# Altium project Pump_Agri.PrjPcb
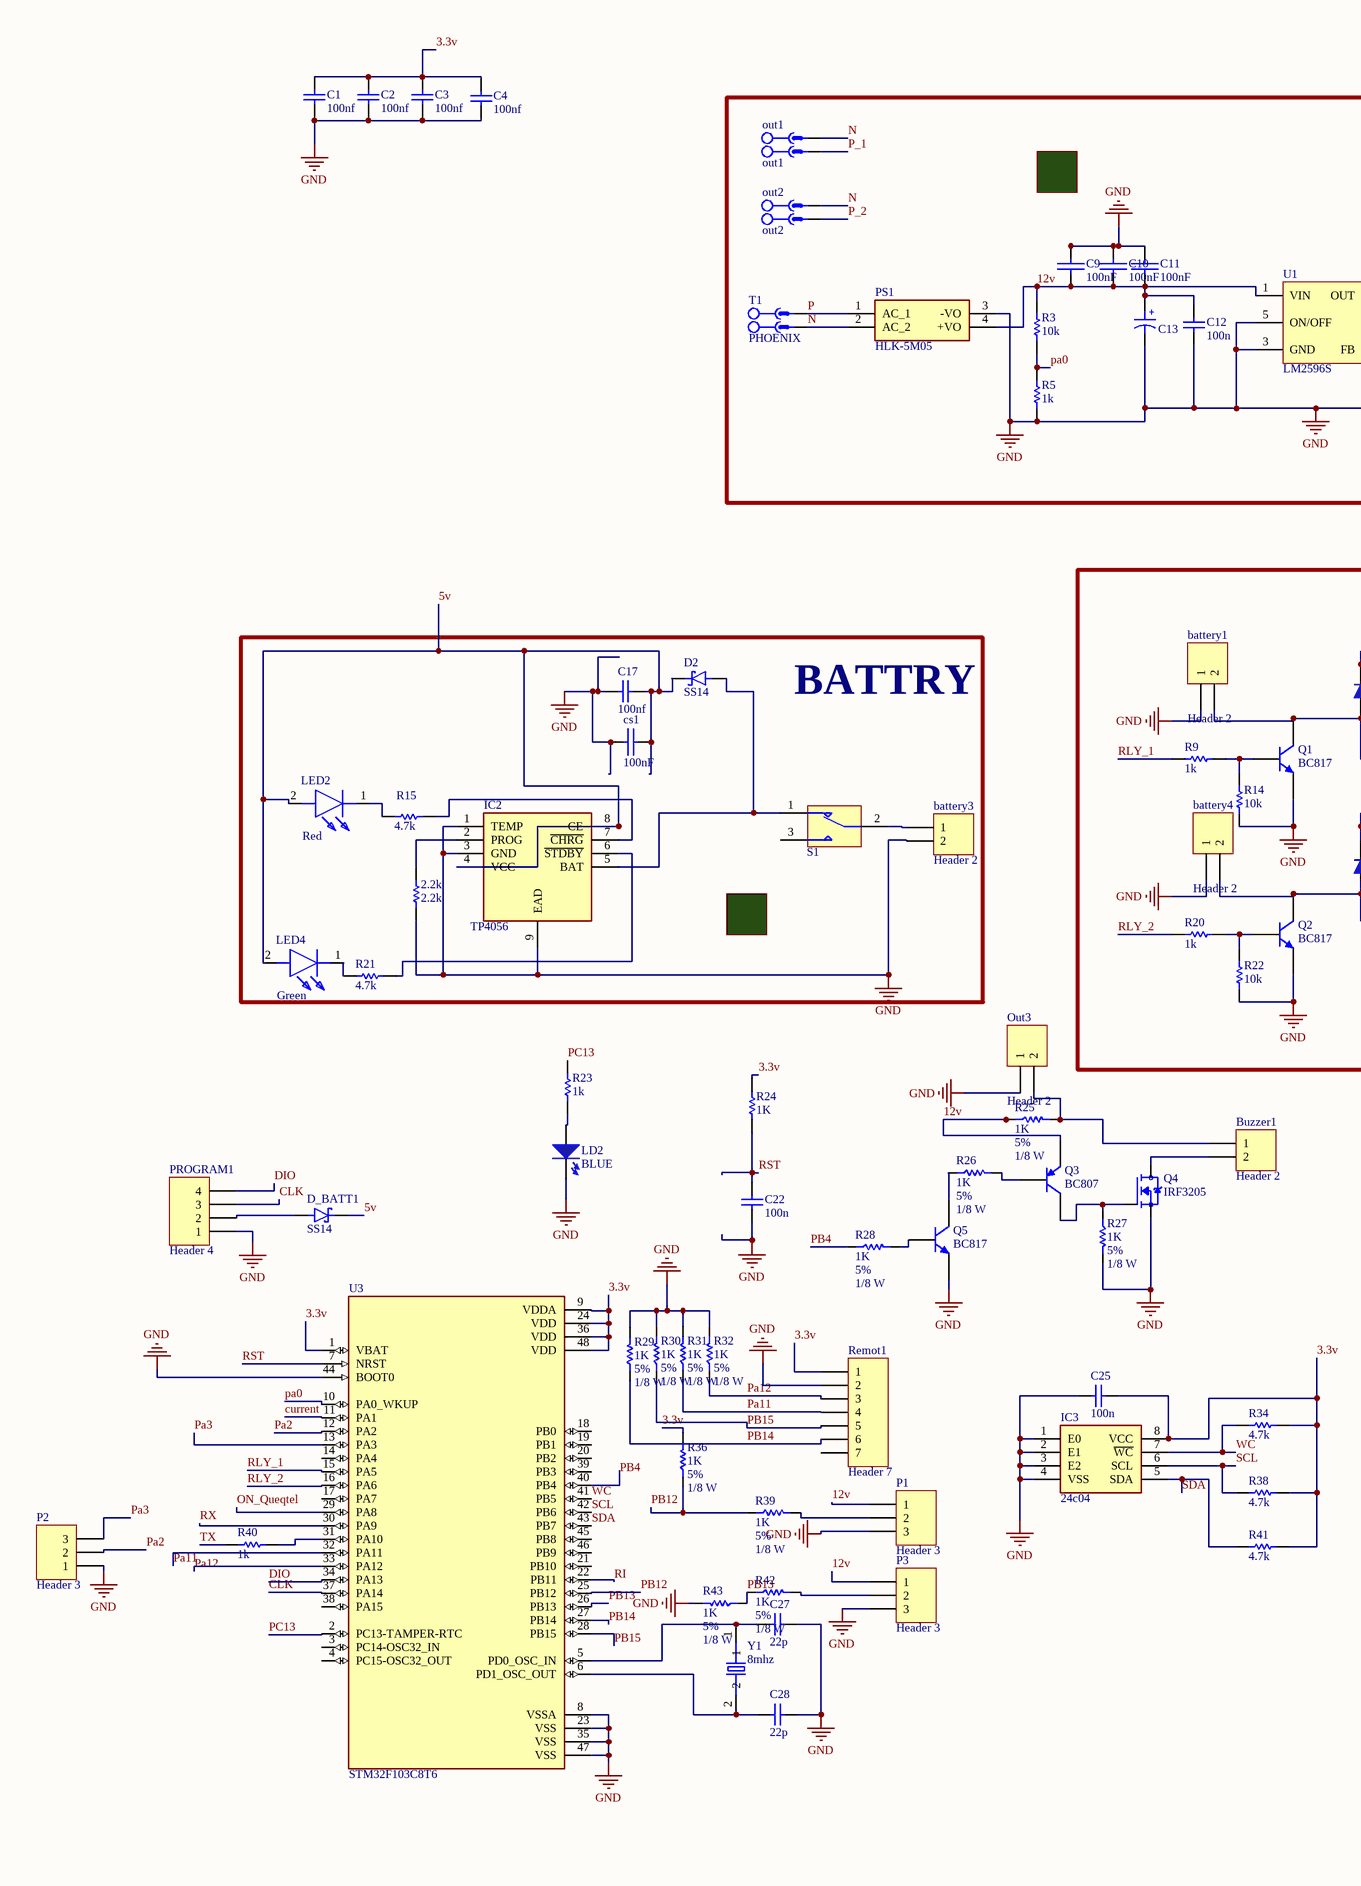
[diagram p0: Pump_Agri.SchDoc, left]
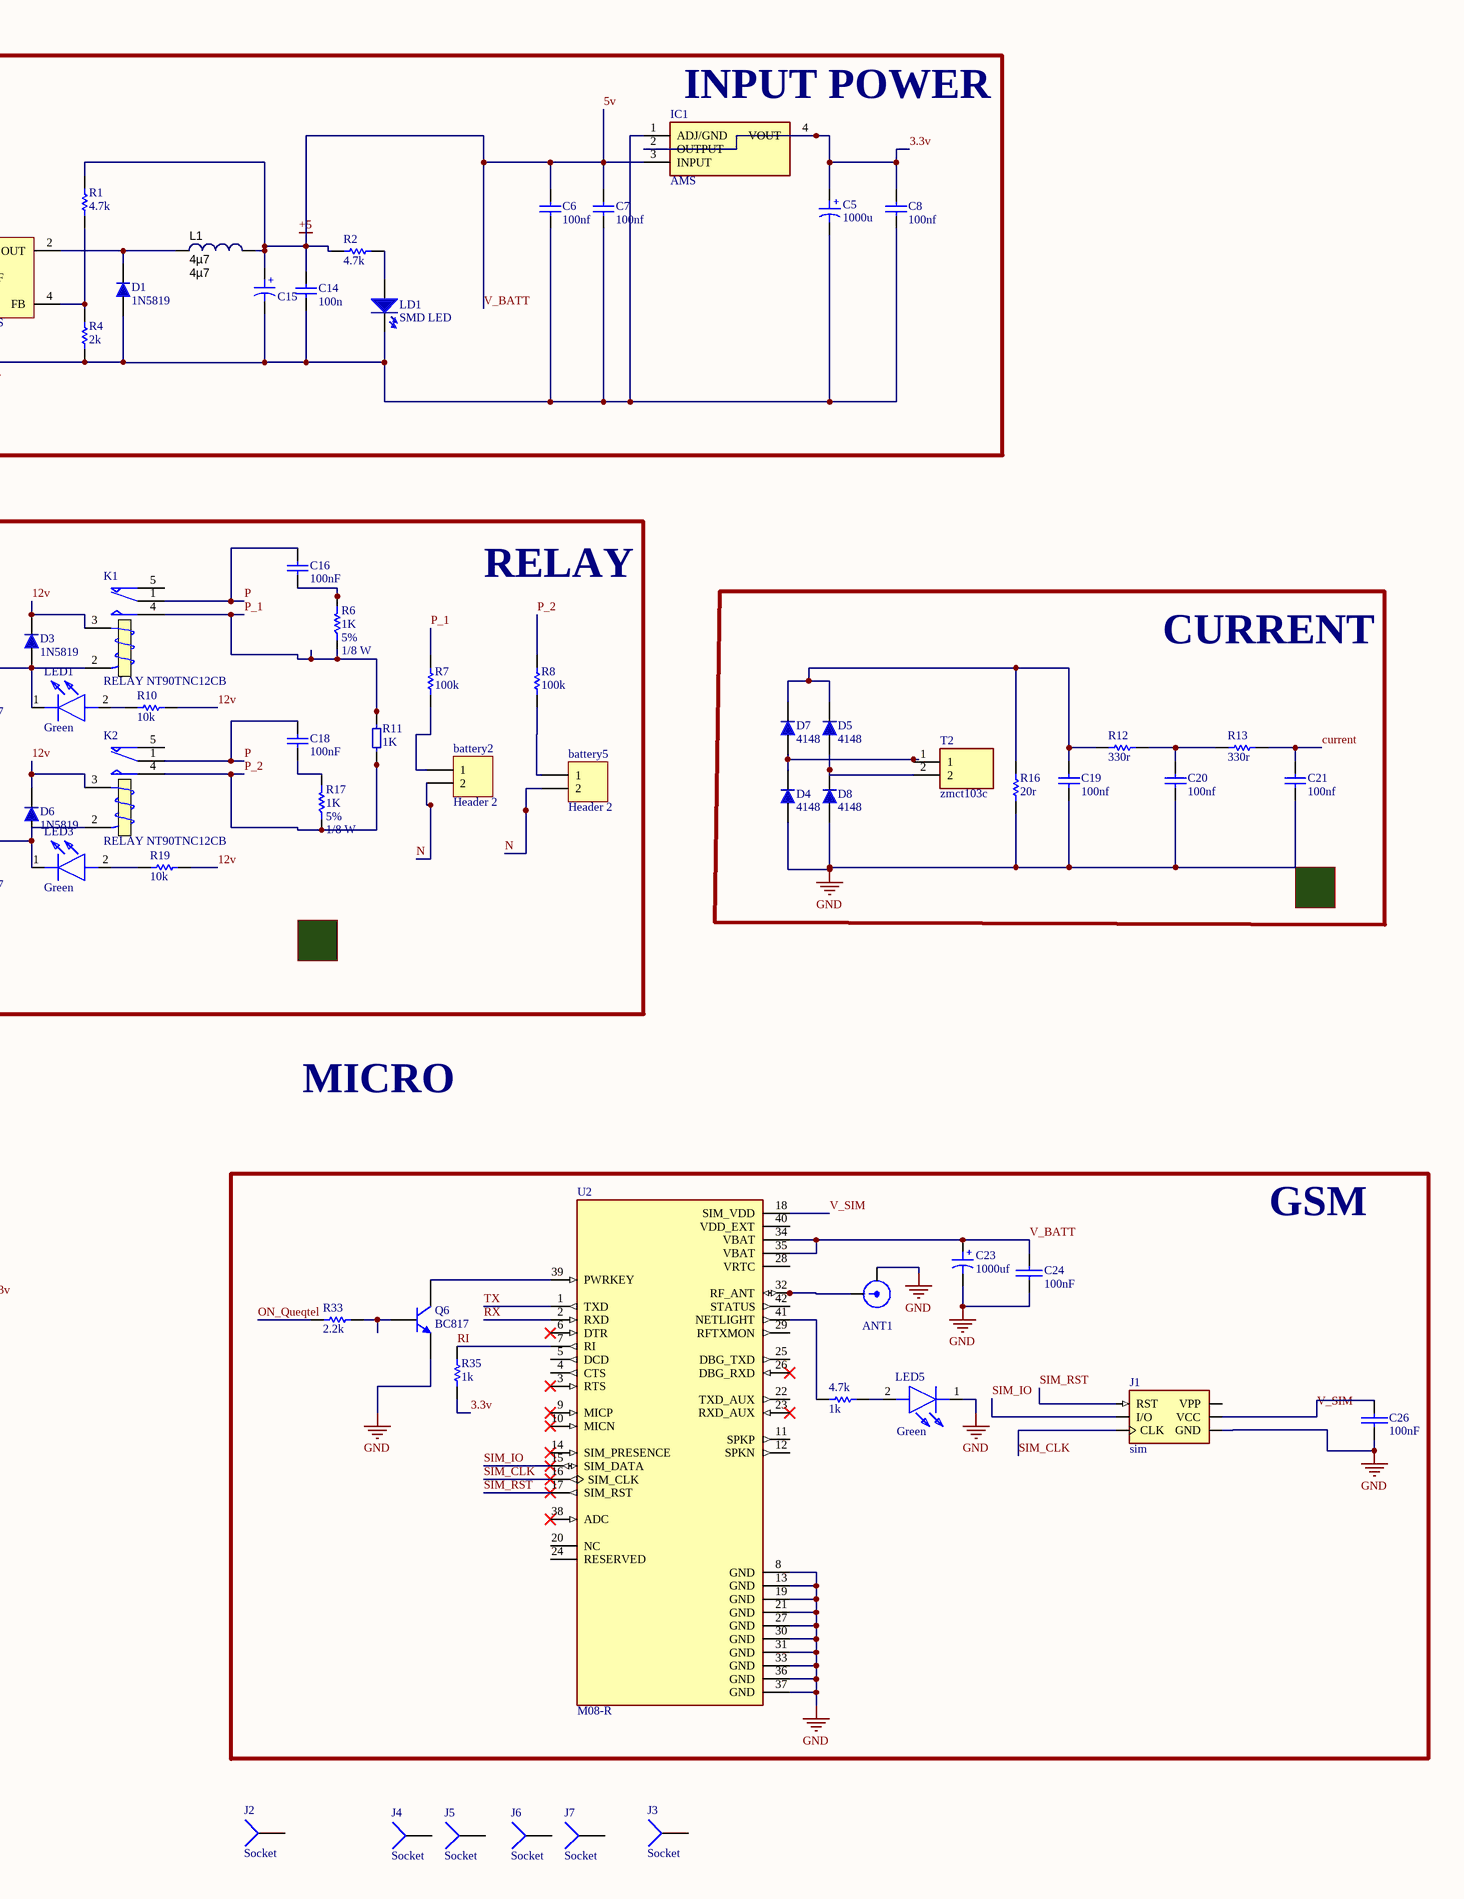
[diagram p1: Pump_Agri.SchDoc, right]
1 sheet, 130 parts. Net scope: global (net labels, ports and power ports of the same name join across sheets).
Board files: Pump_Agri.PcbDoc, PCB2.PcbDoc

## Sheet Pump_Agri.SchDoc
size A2; SheetNumber: 1; SheetTotal: 1

### Parts
2.2k  2.2k  [RESC3413X04N]
4.7k  1k  [RESC3413X04N]
ANT1  ANT U.FL  [U.FL SMD]  (value not drawn)
battery1  Header 2  [HDR1X2]
battery2  Header 2  [HDR1X2]
battery3  Header 2  [HDR1X2]
battery4  Header 2  [HDR1X2]
battery5  Header 2  [HDR1X2]
Buzzer1  Header 2  [HDR1X2]
C1  100nf  [CAPC3413X12N]
C2  100nf  [CAPC3413X12N]
C3  100nf  [CAPC3413X12N]
C4  100nf  [CAPC3413X12N]
C5  1000u  [Cap electrolitic radial 8x12-3.5]
C6  100nf  [CAPC3413X12N]
C7  100nf  [CAPC3413X12N]
C8  100nf  [CAPC3413X12N]
C9  100nF  [SMD_CAP_1206]
C10  100nF  [SMD_CAP_1206]
C11  100nF  [SMD_CAP_1206]
C12  100n  [CAPC3413X12N]
C13  1000u  [Cap electrolitic radial 10x20-5]  (value not drawn)
C14  100n  [CAPC3413X12N]
C15  100u  [Cap electrolitic radial 10x20-5]  (value not drawn)
C16  100nF  [Cap-10nF-630V]
C17  100nf  [CAPC3413X12N]
C18  100nF  [Cap-10nF-630V]
C19  100nf  [CAPC3413X12N]
C20  100nf  [CAPC3413X12N]
C21  100nf  [CAPC3413X12N]
C22  100n  [CAPC3413X12N]
C23  1000uf  [Cap electrolitic radial 8x12-3.5]
C24  value 100nF  [CAP0805]  (hidden comment: 100N)
C25  100n  [CAPC3413X12N]
C26  value 100nF  [CAP0805]  (hidden comment: 100N)
C27  22p  [CAPC3413X12N]
C28  22p  [CAPC3413X12N]
cs1  100nF  [SMD_CAP_1206]
D1  1N5819  [DO-214AA(SMA)]
D2  SS14  [DIOM4325X250N]
D3  1N5819  [DO-214AA(SMA)]
D4  4148  [SOD80, LL-34]
D5  4148  [SOD80, LL-34]
D6  1N5819  [DO-214AA(SMA)]
D7  4148  [SOD80, LL-34]
D8  4148  [SOD80, LL-34]
D_BATT1  SS14  [DIOM4325X250N]
IC1  AMS  [SOT230P700X180-4N]
IC2  TP4056  [SOIC127P600X175-9N]
IC3  24c04  [SOIC127P600X175-8N]
J1  sim  [GCT_SIM5060-6-0-26-01-X_REVC]
J2  Socket  [Test Point]
J3  Socket  [Test Point]
J4  Socket  [Test Point]
J5  Socket  [Test Point]
J6  Socket  [Test Point]
J7  Socket  [Test Point]
K1  RELAY NT90TNC12CB  [RELAY NT90TNC12CB]
K2  RELAY NT90TNC12CB  [RELAY NT90TNC12CB]
L1  4µ7  [Inductor SMD 3x3.2mm]
LD1  SMD LED  [LED_0805 G]
LD2  BLUE  [LED_0805 G]
LED1  Green  [LEDC2012X80N]
LED2  Red  [LEDC2012X80N]
LED3  Green  [LEDC2012X80N]
LED4  Green  [LEDC2012X80N]
LED5  Green  [LEDC2012X80N]
out1  out1  [MSTBV 2,5/2-G-5]
out2  out2  [MSTBV 2,5/2-G-5]
Out3  Header 2  [HDR1X2]
P1  Header 3  [HDR1X3]
P2  Header 3  [HDR1X3]
P3  Header 3  [HDR1X3]
PROGRAM1  Header 4  [HDR1X4]
PS1  HLK-5M05  [HLK5M05]
Q1  BC817  [SOT-23]
Q2  BC817  [SOT-23]
Q3  BC807  [SOT23_BEC_N]
Q4  IRF3205  [TO254P1041X444X2933-3]
Q5  BC817  [SOT23_BEC_N]
Q6  BC817  [SOT-23]
R1  4.7k  [RESC3413X04N]
R2  4.7k  [RESC3413X04N]
R3  10k  [RESC3413X04N]
R4  2k  [RESC3413X04N]
R5  1k  [RESC3413X04N]
R6  Tolerance: 5%  Power: 1/8 W  [Res-(1/4)-Stand]  (hidden comment: 1K)
R7  100k  [RESC3413X04N]
R8  100k  [RESC3413X04N]
R9  1k  [RESC3413X04N]
R10  10k  [RESC3413X04N]
R11  Resistor SMD  [2512 Resistor]  (value not drawn)
R12  330r  [RESC3413X04N]
R13  330r  [RESC3413X04N]
R14  10k  [RESC3413X04N]
R15  4.7k  [RESC3413X04N]
R16  20r  [RESC3413X04N]
R17  Tolerance: 5%  Power: 1/8 W  [Res-(1/4)-Stand]  (hidden comment: 1K)
R19  10k  [RESC3413X04N]
R20  1k  [RESC3413X04N]
R21  4.7k  [RESC3413X04N]
R22  10k  [RESC3413X04N]
R23  1k  [RESC3413X04N]
R24  1K  [RESC3413X04N]
R25  Tolerance: 5%  Power: 1/8 W  [RES 1206 (3216X08L)]  (hidden comment: 1K)
R26  value 1K  Tolerance: 5%  Power: 1/8 W  [RES 1206 (3216X08L)]  (hidden comment: 4.7k)
R27  value 1K  Tolerance: 5%  Power: 1/8 W  [RES 1206 (3216X08L)]  (hidden comment: 10k)
R28  value 1K  Tolerance: 5%  Power: 1/8 W  [RES 1206 (3216X08L)]  (hidden comment: 4.7k)
R29  Tolerance: 5%  Power: 1/8 W  [SMD_RES_1206]  (hidden comment: 1K)
R30  Tolerance: 5%  Power: 1/8 W  [SMD_RES_1206]  (hidden comment: 1K)
R31  Tolerance: 5%  Power: 1/8 W  [SMD_RES_1206]  (hidden comment: 1K)
R32  Tolerance: 5%  Power: 1/8 W  [SMD_RES_1206]  (hidden comment: 1K)
R33  2.2k  [RESC3413X04N]
R34  4.7k  [RESC3413X04N]
R35  1k  [RESC3413X04N]
R36  value 1K  Tolerance: 5%  Power: 1/8 W  [SMD_RES_1206]  (hidden comment: 4.7k)
R38  4.7k  [RESC3413X04N]
R39  value 1K  Tolerance: 5%  Power: 1/8 W  [SMD_RES_1206]  (hidden comment: 330r)
R40  1k  [RESC3413X04N]
R41  4.7k  [RESC3413X04N]
R42  value 1K  Tolerance: 5%  Power: 1/8 W  [SMD_RES_1206]  (hidden comment: 10k)
R43  value 1K  Tolerance: 5%  Power: 1/8 W  [SMD_RES_1206]  (hidden comment: 2.2k)
Remot1  Header 7  [HDR1X7]
S1  Switch SPDT_Subminiator  [SPDT Subminiator]  (value not drawn)
T1  PHOENIX  [MSTBV 2,5/2-G-5]
T2  zmct103c  [zmct103c]
U1  LM2596S  [TO - 263]
U2  M08-R  [XCVR_M08-R]
U3  STM32F103C8T6  [QFP50P900X900X160-48N]
Y1  8mhz  [XTAL1170X500X450]

### Blocks framed on the sheet
INPUT POWER: C5-C15 D1 IC1 L1 LD1 out1 out2 PS1 R1-R5 T1 U1
RELAY: battery1 battery2 battery4 battery5 C16 C18 D3 D6 K1 K2 LED1 LED3 Q1 Q2 R6-R11 R14 R17 R19 R20 R22
BATTRY: 2.2k battery3 C17 cs1 D2 IC2 LED2 LED4 R15 R21 S1
CURRENT: C19-C21 D4 D5 D7 D8 R12 R13 R16 T2
GSM: 4.7k ANT1 C23 C24 C26 J1 LED5 Q6 R33 R35 U2

### Nets
5v: C6.1 C7.1 C14.2 C15.1 C17.1 C23.1 C24.1(+) cs1.2(-) D2.C(K) D_BATT1.C(K) IC1.3(INPUT) IC2.4(VCC) IC2.8(CE) L1.2 LED2.2(A) LED4.2(A) R1.2 R2.1 U2.34(VBAT) U2.35(VBAT)  [also labelled +5, V_BATT]
GND: 2.2k.2 ANT1.2 battery1.1 battery3.2 battery4.1 C1.1 C2.1 C3.1 C4.1 C5.2 C6.2 C7.2 C8.2 C9.2(-) C10.2(-) C11.2(-) C12.1 C13.2 C14.1 C15.2 C17.2 C19.1 C20.1 C21.1 C22.1 C23.2 C24.2(-) C25.2 C26.2(-) C27.1 C28.1 cs1.1(+) D1.1 D4.1 D8.1 IC1.1(ADJ/GND) IC2.1(TEMP) IC2.3(GND) IC2.9(EAD) IC3.1(E0) IC3.2(E1) IC3.3(E2) IC3.4(VSS) J1.C5(GND) LD1.2(K) LD2.2(K) LED5.1(K) Out3.1 P1.3 P2.1 P3.3 PROGRAM1.1 PS1.3(-VO) Q1.2(E) Q2.2(E) Q4.3(S) Q5.2(E) Q6.2(E) R4.1 R5.1 R14.2 R16.1 R22.2 R27.2 R29.2 R30.2 R31.2 R32.2 R43.2 Remot1.2 U1.3(GND) U1.5(ON/OFF) U2.8(GND) U2.13(GND) U2.19(GND) U2.21(GND) U2.27(GND) U2.30(GND) U2.31(GND) U2.33(GND) U2.36(GND) U2.37(GND) U3.8(VSSA) U3.23(VSS) U3.35(VSS) U3.44(BOOT0) U3.47(VSS)
3.3v: C1.2 C2.2 C3.2 C4.2 C5.1 C8.1 C25.1 IC1.2(OUTPUT) IC1.4(VOUT) IC3.8(VCC) R24.2 R34.2 R35.2 R36.2 R38.2 R41.2 Remot1.1 U3.1(VBAT) U3.9(VDDA) U3.24(VDD) U3.36(VDD) U3.48(VDD)
12v: C9.1(+) C10.1(+) C11.1(+) C12.2 C13.1 D3.2 D6.2 K1.3(T1) K2.3(T1) P1.1 P3.1 PS1.4(+VO) Q3.2(E) R3.2 R10.1 R19.1 R25.1 U1.1(VIN)
CLK: PROGRAM1.3 U3.37(PA14)
current: C21.2 R13.2 U3.11(PA1)
DIO: PROGRAM1.4 U3.34(PA13)
N: battery2.2 battery5.2 out1.2 out2.2 PS1.2(AC_2) T1.1
ON_Queqtel: R33.2 U3.29(PA8)
P: C16.2 C18.2 K1.1(COM) K2.1(COM) PS1.1(AC_1) T1.2
P_1: K1.4(NO) out1.1 R6.1 R7.1 R11.2
P_2: K2.4(NO) out2.1 R8.1 R11.1 R17.1
pa0: R3.1 R5.2 U3.10(PA0_WKUP)
Pa2: P2.2 U3.12(PA2)
Pa3: P2.3 U3.13(PA3)
Pa11: R31.1 Remot1.4 U3.32(PA11)
Pa12: R32.1 Remot1.3 U3.33(PA12)
PB4: R28.1 U3.40(PB4)
PB12: R36.1 R39.1 U3.25(PB12)
PB13: R42.1 R43.1 U3.26(PB13)
PB14: R29.1 Remot1.6 U3.27(PB14)
PB15: R30.1 Remot1.5 U3.28(PB15)
PC13: R23.1 U3.2(PC13-TAMPER-RTC)
RI: R35.1 U2.7(RI) U3.22(PB11)
RLY_1: R9.2 U3.15(PA5)
RLY_2: R20.2 U3.16(PA6)
RST: C22.2 R24.1 U3.7(NRST)
RX: U2.2(RXD) U3.30(PA9)
SCL: IC3.6(SCL) R38.1 U3.42(PB6)
SDA: IC3.5(SDA) R41.1 U3.43(PB7)
SIM_CLK: J1.C3(CLK) U2.16(SIM_CLK)
SIM_IO: J1.C7(I/O) U2.15(SIM_DATA)
SIM_RST: J1.C2(RST) U2.17(SIM_RST)
TX: R40.2 U2.1(TXD)
V_SIM: C26.1(+) J1.C1(VCC) U2.18(SIM_VDD)
WC: IC3.7(~{WC}) R34.1 U3.41(PB5)
Net2.2k_1: 2.2k.1 IC2.2(PROG)
Net4.7k_1: 4.7k.1 U2.41(NETLIGHT)
Net4.7k_2: 4.7k.2 LED5.2(A)
NetANT1_1: ANT1.1 U2.32(RF_ANT)
Netbattery1_2: battery1.2 D3.1 K1.2(T2) LED1.1(K) Q1.3(C)
Netbattery2_1: battery2.1 R7.2
Netbattery3_1: battery3.1 S1.2
Netbattery4_2: battery4.2 D6.1 K2.2(T2) LED3.1(K) Q2.3(C)
Netbattery5_1: battery5.1 R8.2
NetBuzzer1_1: Buzzer1.1 Out3.2 R25.2
NetBuzzer1_2: Buzzer1.2 Q4.2(D)
NetC16_1: C16.1 R6.2
NetC18_1: C18.1 R17.2
NetC19_2: C19.2 D5.2 D7.2 R12.1 R16.2
NetC20_2: C20.2 R12.2 R13.1
NetC27_2: C27.2 U3.5(PD0_OSC_IN) Y1.1
NetC28_2: C28.2 U3.6(PD1_OSC_OUT) Y1.2
NetD1_2: D1.2 L1.1 U1.2(OUT)
NetD2_A: D2.A IC2.5(BAT) S1.1
NetD4_2: D4.2 D7.1 T2.1
NetD5_1: D5.1 D8.2 T2.2
NetD_BATT1_A: D_BATT1.A PROGRAM1.2
NetIC2_6: IC2.6(~{STDBY}) R21.2
NetIC2_7: IC2.7(~{CHRG}) R15.2
NetLD1_1: LD1.1(A) R2.2
NetLD2_1: LD2.1(A) R23.2
NetLED1_2: LED1.2(A) R10.2
NetLED2_1: LED2.1(K) R15.1
NetLED3_2: LED3.2(A) R19.2
NetLED4_1: LED4.1(K) R21.1
NetP1_2: P1.2 R39.2
NetP3_2: P3.2 R42.2
NetQ1_1: Q1.1(B) R9.1 R14.1
NetQ2_1: Q2.1(B) R20.1 R22.1
NetQ3_1: Q3.1(B) R26.2
NetQ3_3: Q3.3(C) Q4.1(G) R27.1
NetQ5_1: Q5.1(B) R28.2
NetQ5_3: Q5.3(C) R26.1
NetQ6_1: Q6.1(B) R33.1
NetQ6_3: Q6.3(C) U2.39(PWRKEY)
NetR1_1: R1.1 R4.2 U1.4(FB)
NetR40_1: R40.1 U3.31(PA10)

Not connected (* = marked no-connect by the designer): J1 C6(VPP); J2 1; J3 1; J4 1; J5 1; J6 1; J7 1; K1 5(NC); K2 5(NC); Remot1 7; S1 3; U2 3(RTS)* 4(CTS) 5(DCD) 6(DTR)* 9(MICP)* 10(MICN)* 11(SPKP) 12(SPKN) 14(SIM_PRESENCE)* 20(NC) 22(TXD_AUX) 23(RXD_AUX)* 24(RESERVED) 25(DBG_TXD) 26(DBG_RXD)* 28(VRTC) 29(RFTXMON) 38(ADC)* 40(VDD_EXT) 42(STATUS); U3 3(PC14-OSC32_IN) 4(PC15-OSC32_OUT) 14(PA4) 17(PA7) 18(PB0) 19(PB1) 20(PB2) 21(PB10) 38(PA15) 39(PB3) 45(PB8) 46(PB9)

### Notes on the sheet
- MICRO
- (in symbol Cap electrolitic radial 10x21) +
- (in symbol Cap ELECTROLITIC TOTAL SIZE) +
- (in symbol Resistor SMD) 1K

### Library data of the parts
2.2k 4.7k R1-R5 R7-R10 R12-R16 R19-R24 R33-R35 R38 R40 R41 = RES 0805 0.125W: RES 0805; Designer: Abbas Basereh; Desc.: RES SMD 0805; Data: 16-12-2016
ANT1 = ANT U.FL: Antenna; Ali Hafizi: Ali Hafizi
battery1-battery5 Buzzer1 Out3 = Header 2: Header, 2-Pin; LatestRevisionDate: 17-Jul-2002; LatestRevisionNote: Re-released for DXP Platform.; Publisher: Altium Limited
C1-C4 C6-C8 C12 C14 C17 C19-C22 C25 C27 C28 = CAP SMD 0805: CAP 0805; Designer: Abbas Basereh; Desc.: CAP SMD 0805; Data: 16-12-2016
C5 C23 = Cap ELECTROLITIC TOTAL SIZE: Cap electrolitic radial; Designer: Abbas Basereh; VALUE: 1uF; Data: 16-12-2016; Part. No: *
C9-C11 C24 C26 cs1 = Cap-Bipolar: Bipolar Capacitor; Voltage: 100V; Designer: Saeid Jorablo; Organazation: ControTec; Adding Date: 1387/12/20
  C9-C11 cs1: Value: 100nF
C13 C15 = Cap electrolitic radial 10x21: Cap electrolitic radial; Part. No: 100U/50V; Designer: Abbas Basereh; Data: 16-12-2016
C16 C18 = CAP CERAMIC TOTAL SIZE: CAP Ceramic Total; Designer: Ali Hafizi
D1 D3 D6 = 1N5819(SS14)
D2 = SS14: 1A, 40V, Schottky Rectifier; MF: Taiwan Semiconductor; SnapEDA_Link: https://www.snapeda.com/parts/SS14/taiwan/view-part/?ref=snap; Package: SMA-2 Taiwan Semiconductor; Value: *; MP: SS14; Check_prices: https://www.snapeda.com/parts/SS14/taiwan/view-part/?ref=eda
D4 D5 D7 D8 = 1N4148UR-1: DIODE GEN PURP 75V 200MA DO213AA; Published: 2017-1-12; PackageVersion: 2017-1-12; PackageReference: DO-213AA&SOD-80; Publisher: Abbas Basereh; PackageDescription: DIODE GEN PURP 75V 200MA DO213AA; ComponentLink1Description: Manufacturer Link; ComponentLink1URL: http://www.digikey.com/product-detail/en/microsemi-corporation/1N4148UR-1/1N4148UR-1-ND/4377991; ComponentLink2Description: Datasheet; PART.NO: 1N4148UR-1
IC1 = LM1117IMPX-ADJ_NOPB: Integrated Circuit; Manufacturer_Name: Texas Instruments; Manufacturer_Part_Number: LM1117IMPX-ADJ/NOPB; Datasheet Link: http://www.ti.com/general/docs/suppproductinfo.tsp?distId=10&gotoUrl=http%3A%2F%2Fwww.ti.com%2Flit%2Fgpn%2Flm1117; Height: 1.8mm; Mouser Part Number: 926-M1117IMPXADJNOPB; Mouser Price/Stock: https://www.mouser.co.uk/ProductDetail/Texas-Instruments/LM1117IMPX-ADJ-NOPB?qs=X1J7HmVL2ZH7x9eSBiUHaQ%3D%3D; Arrow Part Number: LM1117IMPX-ADJ/NOPB; Arrow Price/Stock: https://www.arrow.com/en/products/lm1117impx-adjnopb/texas-instruments?region=europe
IC2 = TP4056X: Integrated Circuit; Manufacturer_Name: Nanjing Extension Microelectronics; Datasheet Link: https://datasheet.lcsc.com/szlcsc/Nanjing-Extension-Microelectronics-TP4056X_C191323.pdf; Height: 1.75mm; Manufacturer_Part_Number: TP4056X
IC3 = M24C02-RMN6P: Integrated Circuit; Manufacturer_Name: STMicroelectronics; Datasheet Link: http://www.st.com/st-web-ui/static/active/en/resource/technical/document/datasheet/DM00071904.pdf; Height: 1.75mm; Manufacturer_Part_Number: M24C02-RMN6P; Mouser Part Number: 511-M24C02-RMN6P; Mouser Price/Stock: https://www.mouser.co.uk/ProductDetail/STMicroelectronics/M24C02-RMN6P?qs=Au9%252BK7QVGzXd5M2vTlbyeA%3D%3D; Arrow Part Number: M24C02-RMN6P; Arrow Price/Stock: https://www.arrow.com/en/products/m24c02-rmn6p/stmicroelectronics
J1 = SIM5060-6-0-26-01-X_REVC: SIM Card Connector, Hinged Type 6 Pin, SMT, 2.6mm Profile, Optional Locating Post; MF: Global Connector Technology; MP: SIM5060-6-0-26-01-X; Availability: Unavailable; Package: None; Value: *; Price: None; SnapEDA_Link: https://www.snapeda.com/parts/SIM5060-6-0-26-01-X/Global%20Connector%20Technology/view-part/779299/?ref=snap
K1 K2 = RELAY NT90TNC12CB: Relay_SPDT POWER NEEDLE; Designer: Abbas Basereh; PackageDescription: 31.7x26.7x28; PackageReference: RELAY NT90TNC12CB; Mounting Technology: Through-Hole; Value: RELAY NT90TNC12CB; ComponentLink1Description: Datasheet; Pin Count: 0; Update Date: 2017-3-4; Category: NT90TNC12CB
L1 = Inductor 4.7µH SMD 3x3.2mm: Tolerance: ±20%; Type: Ferrite Core; SCDType: source; Package / Case: Inductor 4.7µH SMD 3x3.2mm; Supplier 1: Digi-Key; Operating Temperature: -40°C ~ 125°C; Value: 4µ7
LD1 LD2 = LED SMD
LED1-LED5 = 150080BS75000: LED; Manufacturer_Name: Wurth Elektronik; Datasheet Link: https://katalog.we-online.com/led/datasheet/150080BS75000.pdf; Height: 0.8mm; Manufacturer_Part_Number: 150080BS75000; Mouser Part Number: 710-150080BS75000; Mouser Price/Stock: https://www.mouser.co.uk/ProductDetail/Wurth-Elektronik/150080BS75000?qs=2kOmHSv6VfT2tBo3UPVqAQ%3D%3D
out1 out2 T1 = CON_Phoenix_MSTBV_02: 2 Pitch: 5 mm Color: green Contact surface: Tin Assembly; Manufacturer: PHOENIX CONTACT; Connector type: PCB Terminal Block; designer: ABBAS BASEREH; Max Current: 12 A; Positions: 2; Voltage: 320 V; Category: Connector; ComponentLink1Description: Header, Nominal current: 12 A Rated voltage (III/2): 320 V Number of positions: 2 Pitch: 5 mm Color: green Contact surface: Tin Assembly: Soldering  DESIGNER:ABBAS BASEREH; ComponentLink2Description: Reference; Mounting Technology: Through-Hole; Pin Count: 2; Revision 1: 2017-3-1; Status: Unreleased; PART.NO: PHOENIX
P1-P3 = Header 3: Header, 3-Pin; LatestRevisionDate: 17-Jul-2002; LatestRevisionNote: Re-released for DXP Platform.; Publisher: Altium Limited
PROGRAM1 = Header 4: Header, 4-Pin; LatestRevisionDate: 17-Jul-2002; LatestRevisionNote: Re-released for DXP Platform.; Publisher: Altium Limited
PS1 = HLK-5M05: Power Supply; Manufacturer_Name: Hi-Link; Datasheet Link: http://www.hlktech.net/product_detail.php?ProId=60; Height: 18mm; Manufacturer_Part_Number: HLK-5M05
Q3 = PNP: PNP Bipolar Transistor; Published: 8-Jun-2000; LatestRevisionDate: 29-May-2009; LatestRevisionNote: IPC-7351 Footprint Added.; PackageVersion: Aug-1999; PackageReference: SOT-23B; Publisher: Altium Limited; PackageDescription: 3-Pin SOT-23 Package 0.95 mm Pitch, 2.4 mm Lead Span
Q4 = IRF3205: N-Channel 55V 110A (Tc) 200W (Tc) Through Hole TO-220AB; MF: Infineon Technologies; SnapEDA_Link: https://www.snapeda.com/parts/IRF3205/Infineon+Technologies/view-part/?ref=snap; Package: TO-220 Infineon; Value: *; MP: IRF3205; Check_prices: https://www.snapeda.com/parts/IRF3205/Infineon+Technologies/view-part/?ref=eda
Q5 = NPN: NPN Bipolar Transistor; Published: 8-Jun-2000; LatestRevisionDate: 29-May-2009; LatestRevisionNote: IPC-7351 Footprint Added.; PackageVersion: Aug-1999; PackageReference: SOT-23B; Publisher: Altium Limited; PackageDescription: 3-Pin SOT-23 Package 0.95 mm Pitch, 2.4 mm Lead Span
R6 R17 R25-R32 R36 R39 R42 R43 = Resistor
  R6 R17 R25 R29-R32: Value: 1K
Remot1 = Header 7: Header, 7-Pin; LatestRevisionDate: 17-Jul-2002; LatestRevisionNote: Re-released for DXP Platform.; Publisher: Altium Limited
S1 = Switch SPDT_Subminiator: Subminiator SPDT Switch; Company: E.P.I.L; Design date: 2011/11/02
T2 = zmct103c: Transformer; Manufacturer_Name: Qingxian Zeming Langxi Electronic; Datasheet Link: https://www.alldatasheet.com/datasheet-pdf/pdf/1150711/ETC2/ZMCT103D.html; Height: 19.2mm; Manufacturer_Part_Number: zmct103c
U3 = STM32F103C8T6: ARM® Cortex®-M3 STM32F1 Microcontroller IC 32-Bit 72MHz 64KB (64K x 8) FLASH 48-LQFP (7x7); MF: STMicroelectronics; SnapEDA_Link: https://www.snapeda.com/parts/STM32F103C8T6/STMicroelectronics/view-part/?ref=snap; Package: LQFP-48 STMicroelectronics; Value: *; MP: STM32F103C8T6; Check_prices: https://www.snapeda.com/parts/STM32F103C8T6/STMicroelectronics/view-part/?ref=eda
Y1 = FOXSDLF/120-20: CRYSTAL, 12MHz, 20PF, SMD; Frequency:12MHz; Frequency Tolerance:Â± 30ppm; Load Capacitance:20pF; Operating Temperature Range:-20Â°C to +70Â°C; Crystal Mounting Type:SMD; Crystal Case Type:HC-49S; No. of Pins:2; MSL:MSL 1 - Unlimited; MF: Fox Electronics; SnapEDA_Link: https://www.snapeda.com/parts/FOXSDLF/120-20/Fox+Electronics/view-part/?ref=snap; Package: HC49SD Fox Electronics; Value: 8mhz; MP: FOXSDLF/120-20; Check_prices: https://www.snapeda.com/parts/FOXSDLF/120-20/Fox+Electronics/view-part/?ref=eda
D_BATT1 = SS14: Value: *; Availability: Unavailable; Price: None; Package: None; MP: SS14
J2-J7 = Socket: LatestRevisionDate: 17-Jul-2002; LatestRevisionNote: Re-released for DXP Platform.; Publisher: Altium Limited
U2 = M08-R: Price: None; Availability: Unavailable; Package: None; MP: M08-R; Value: *